# EAGLE design JDM2-2voltage-new-broken (EAGLE 7.6.0)
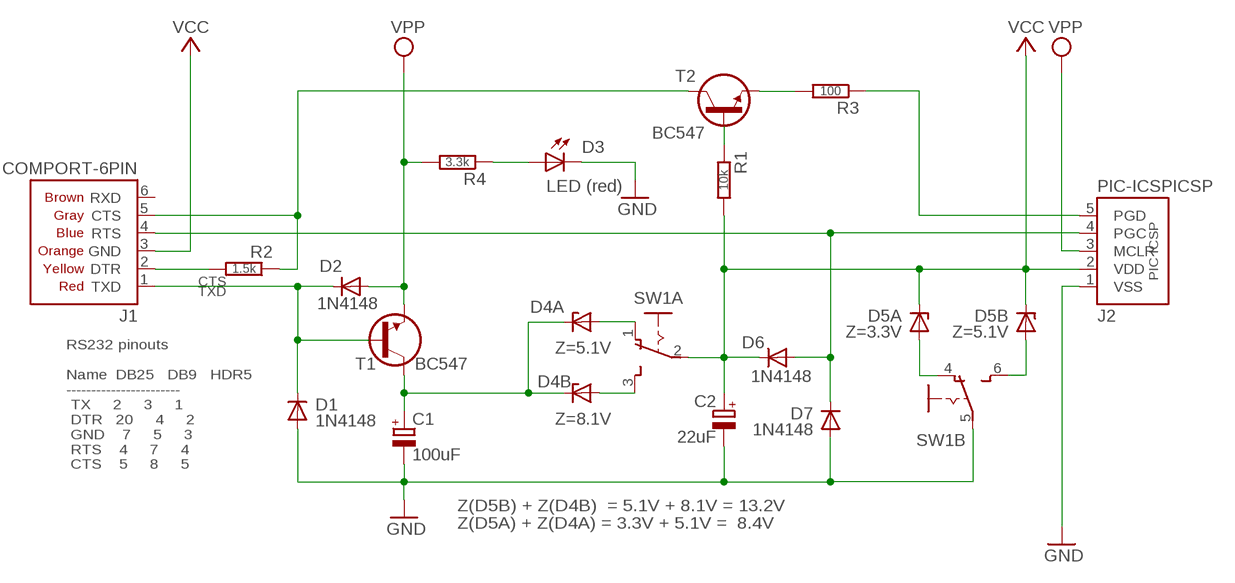
[diagram p0: schematic, sheet 1]

## Parts
C1  100uF  CPOLE5-4  [E5-4]
C2  22uF  CPOLE2,5-4  [E2,5-4]
D1  1N4148  1N414834-5  [DO34-5]
D2  1N4148  1N414834-5  [DO34-5]
D3  LED (red)  LED3MM  [LED3MM]
D4A  Z=5.1V  Z-DIODE34Z7  [DO34Z7]
D4B  Z=8.1V  Z-DIODE34Z7  [DO34Z7]
D5A  Z=3.3V  Z-DIODE34Z7V  [DO34Z7V]
D5B  Z=5.1V  Z-DIODE34Z7V  [DO34Z7V]
D6  1N4148  1N414834-7V  [DO34-7V]
D7  1N4148  1N414834-5V  [DO34-5V]
J1  COMPORT-6PIN  [RS232-6PIN]
J2  PIC-ICSPICSP  [PIC-ICSP]
R1  10k  R0202/7-V  [0202/7-V]
R2  1.5k  R0202/7-V  [0202/7-V]
R3  100  R0202/7  [0202/7]
R4  3.3k  R0202/7  [0202/7]
SW1  SL-SW-2P-2T-S  [SLSW-2P2T-H]
T1  BC547  BC547CBE  [TO92-CBE]
T2  BC547  BC547CBE  [TO92-CBE]

## Nets
/MCLR: D2.A J2.3(MCLR) R4.2 T1.E ; supply symbol labelled VPP
CLK: D6.A D7.C J1.4(RTS) J2.4(PGC)
CTS: J1.5(CTS) R2.1 T2.C
DATA: R3.2 T2.E
GND: C1.- C2.- D1.A D3.K(C) D7.A J2.1(VSS) SW1.5(B:P)
N$1: R1.1 T2.B
N$2: D5A.A SW1.4(B:O)
N$3: D5B.A SW1.6(B:S)
N$4: D4A.A SW1.1(A:O)
N$5: D3.A R4.1
N$6: D4B.A SW1.3(A:S)
N$7: J1.2(DTR) R2.2
PGD: J2.5(PGD) R3.1
TXD: D1.C D2.C J1.1(TXD) T1.B
VCC: C2.+ D5A.C D5B.C D6.C J1.3(GND) J2.2(VDD) R1.2 SW1.2(A:P)
VPP: C1.+ D4A.C D4B.C T1.C
Unconnected: J1.6(RXD)

## Notes on the sheet
- RS232 pinouts
  
  Name  DB25   DB9   HDR5
  -----------------------
   TX     2     3     1
   DTR   20     4     2
   GND    7     5     3
   RTS    4     7     4
   CTS    5     8     5
- Z(D5B) + Z(D4B)  = 5.1V + 8.1V = 13.2V
  Z(D5A) + Z(D4A) = 3.3V + 5.1V =  8.4V

## Library data of the parts
C1 C2 = c:CPOL: POLARIZED CAPACITOR, European symbol
D1 D2 D6 D7 = d:1N4148
D3 = led:LED: LED OSRAM: - CHIPLED LG R971, LG N971, LY N971, LG Q971, LY Q971, LO R971, LY R971 LH N974, LH R974 LS Q976, LO Q976, LY Q976 LO Q996 - Hyper CHIPLED LW Q18S LB Q993, LB Q99A, LB R99A - SideLED LS A670, LO A670, LY A670, LG A670, LP A670 LB A673, LV A673, LT A673, LW A673 LH A674 LY A675 LS A676, LA A676, LO A676, LY A676, LW A676 LS A679, LY A679, LG A679 - Hyper Micro SIDELED® LS Y876, LA Y876, LO Y876, LY Y876 LT Y87S - SmartLED LW L88C, LW L88S LB L89C, LB L89S, LG L890 LS L89K, LO L89K, LY L89K LS L896, LA L896, LO L896, LY L896 - TOPLED LS T670, LO T670, LY T670, LG T670, LP T670 LSG T670, LSP T670, LSY T670, LOP T670, LYG T670 LG T671, LOG T671, LSG T671 LB T673, LV T673, LT T673, LW T673 LH T674 LS T676, LA T676, LO T676, LY T676, LB T676, LH T676, LSB T676, LW T676 LB T67C, LV T67C, LT T67C, LS T67K, LO T67K, LY T67K, LW E67C LS E67B, LA E67B, LO E67B, LY E67B, LB E67C, LV E67C, LT E67C LW T67C LS T679, LY T679, LG T679 LS T770, LO T770, LY T770, LG T770, LP T770 LB T773, LV T773, LT T773, LW T773 LH T774 LS E675, LA E675, LY E675, LS T675 LS T776, LA T776, LO T776, LY T776, LB T776 LHGB T686 LT T68C, LB T68C - Hyper Mini TOPLED® LB M676 - Mini TOPLED Santana® LG M470 LS M47K, LO M47K, LY M47K Source: http://www.osram.convergy.de LUXEON: - LUMILED® LXK2-PW12-R00, LXK2-PW12-S00, LXK2-PW14-U00, LXK2-PW14-V00 LXK2-PM12-R00, LXK2-PM12-S00, LXK2-PM14-U00 LXK2-PE12-Q00, LXK2-PE12-R00, LXK2-PE12-S00, LXK2-PE14-T00, LXK2-PE14-U00 LXK2-PB12-K00, LXK2-PB12-L00, LXK2-PB12-M00, LXK2-PB14-N00, LXK2-PB14-P00, LXK2-PB14-Q00 LXK2-PR12-L00, LXK2-PR12-M00, LXK2-PR14-Q00, LXK2-PR14-R00 LXK2-PD12-Q00, LXK2-PD12-R00, LXK2-PD12-S00 LXK2-PH12-R00, LXK2-PH12-S00 LXK2-PL12-P00, LXK2-PL12-Q00, LXK2-PL12-R00 Source: www.luxeon.com KINGBRIGHT: KA-3528ASYC Source: www.kingbright.com
D4A D4B D5A D5B = d:Z-DIODE
J1 = pinconn:COMPORT-6PIN
J2 = pinconn:PIC-ICSP
R1-R4 = r:R: RESISTOR, European symbol
SW1 = sw:SL-SW-2P-2T-S
T1 T2 = t:BC547

## Net classes
0 default: width 0.559 mm
1 power: width 0.559 mm

## Board
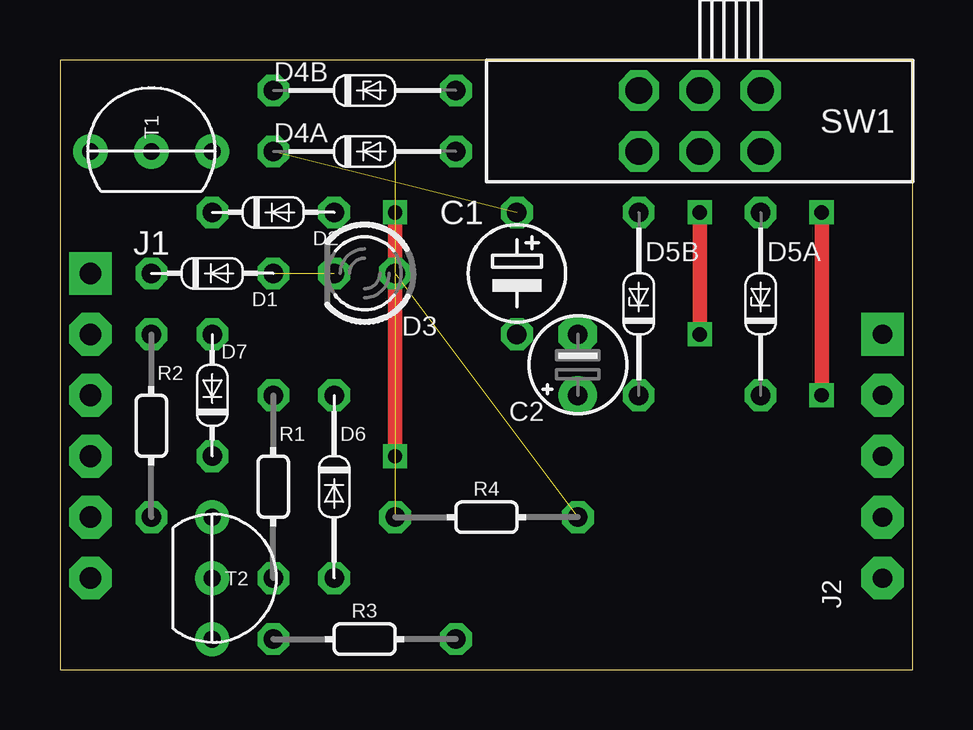
[diagram p1: board, top side]
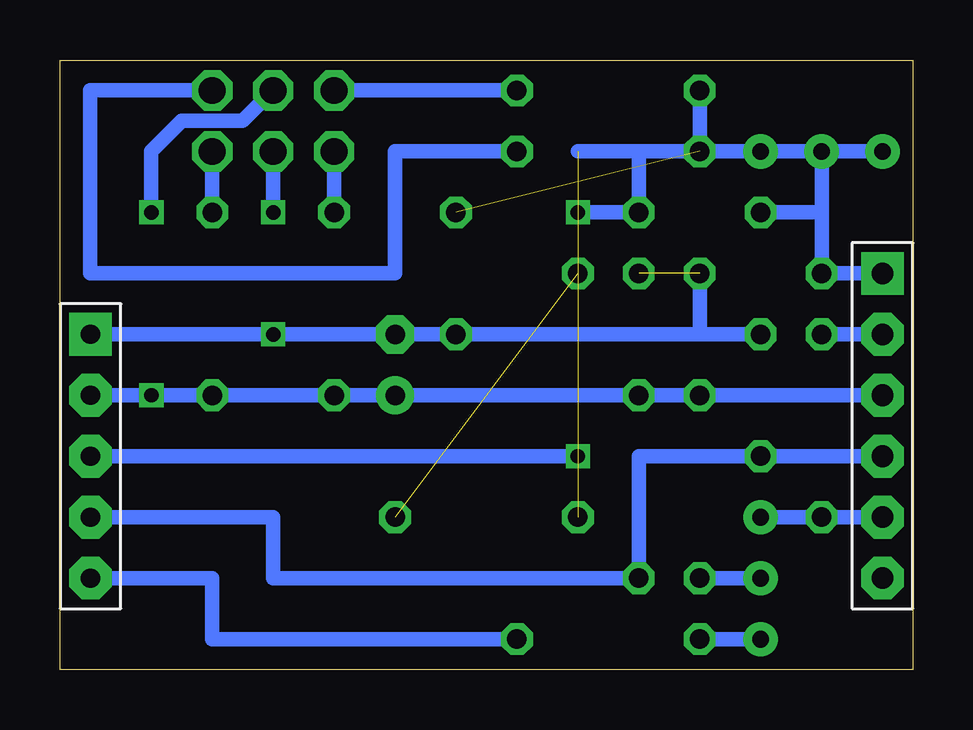
[diagram p2: board, bottom side, seen from below]

Size 35.56 x 25.4 mm. Coordinates in mm from the lower left corner, seen from the top.
Outline: 35.56,0 35.56,25.4 0,25.4 0,0 35.56,0
Copper layers (1*16): Top 0.035mm / dielectric 1.5mm / Bottom 0.035mm
Design rules "default": minimum track width 10mil, minimum drill 24mil, track to track 8mil, track to pad 8mil, pad to pad 8mil, via to via 8mil, smd to smd 8mil, copper to edge 40mil, drill to drill 8mil, minimum pad ring 10mil, minimum via ring 8mil, stop-mask expansion 4mil, vias tented up to drill 0mil, thermal gap 10mil

### Footprints (pad centres in the part's own frame; a part is rotated, then mirrored left to right if it is on the bottom)
E5-4 = drill 0.813 octagon: + 0,2.54; - 0,-2.54
E2,5-4 = drill 0.813 pad 1.6: + 0,-1.27 | drill 0.813 pad 1.6 octagon: - 0,1.27
DO34-5 = drill 0.813 octagon: A 2.54,0; C -2.54,0
LED3MM = drill 0.813 octagon: A -1.27,0; K 1.27,0
DO34Z7 = drill 0.813 octagon: A 3.81,0; C -3.81,0
DO34Z7V = drill 0.813 octagon: A 0,3.81; C 0,-3.81
DO34-7V = drill 0.813 octagon: A 0,3.81; C 0,-3.81
DO34-5V = drill 0.813 octagon: A 0,2.54; C 0,-2.54
RS232-6PIN = drill 0.9 pad 1.778 square: 1 0,0 | drill 0.9 pad 1.778 octagon: 2 2.54,0; 3 5.08,0; 4 7.62,0; 5 10.16,0; 6 12.7,0
PIC-ICSP = drill 0.8 pad 1.778 square: 1 -5.08,0 | drill 0.8 pad 1.778 octagon: 2 -2.54,0; 3 0,0; 4 2.54,0; 5 5.08,0
0202/7-V = drill 0.813 octagon: 1 0,-3.81; 2 0,3.81
0202/7 = drill 0.813 octagon: 1 -3.81,0; 2 3.81,0
SLSW-2P2T-H = drill 1.118 pad 1.524 octagon: 1 2.54,1.27; 2 0,1.27; 3 -2.54,1.27; 4 2.54,-1.27; 5 0,-1.27; 6 -2.54,-1.27
TO92-CBE = drill 0.7 pad 1.422: B 0,0; C 0,2.54; E 0,-2.54

### Placement (x,y rotation side)
C1  19.05,16.51 0 top
C2  21.59,12.7 0 top
D1  6.35,16.51 0 top
D2  8.89,19.05 0 top
D3  12.7,16.51 180 top
D4A  12.7,21.59 0 top
D4B  12.7,24.13 0 top
D5A  29.21,15.24 0 top
D5B  24.13,15.24 0 top
D6  11.43,7.62 180 top
D7  6.35,11.43 0 top
J1  1.27,16.51 270 top
J2  34.29,8.89 270 top
R1  8.89,7.62 0 top
R2  3.81,10.16 0 top
R3  12.7,1.27 180 top
R4  17.78,6.35 180 top
SW1  26.67,22.86 0 top
T1  3.81,21.59 90 top
T2  6.35,3.81 0 top

### Tracks (layer width: path | path; a pad name or v marks a point on that pad's centre or on a via)
/MCLR  (via drill 0.6)  (1 unrouted)
  Top 0.61: v13.97,8.89 v13.97,19.05
  Bottom 0.61: J2.3 v13.97,8.89 | 13.97,21.59 11.43,21.59 | 11.43,21.59 T1.E | v13.97,19.05 D2.A 11.43,21.59
CLK
  Bottom 0.61: J1.4 D7.C 11.43,8.89 D6.A 26.67,3.81 26.67,6.35 J2.4
CTS
  Bottom 0.61: J1.5 R2.1 T2.C
DATA  (via drill 0.6)
  Bottom 0.61: R3.2 T2.E
  other vias: 8.89,1.27 8.89,1.27
GND  (via drill 0.6)  (1 unrouted)
  Top 0.61: v26.67,19.05 v26.67,13.97
  Bottom 0.61: SW1.5 v26.67,19.05 | J2.1 v26.67,13.97 C2.- C1.- 8.89,13.97 | 8.89,13.97 D1.A | D7.A 8.89,13.97
N$1
  Bottom 0.61: R1.1 T2.B
N$2
  Bottom 0.61: D5A.A SW1.4
N$3
  Bottom 0.61: SW1.6 D5B.A
N$4
  Bottom 0.61: SW1.1 34.29,24.13 34.29,16.51 21.59,16.51 21.59,21.59 D4A.A
N$5  (1 unrouted)
N$6
  Bottom 0.61: D4B.A SW1.3
N$7
  Bottom 0.61: R2.2 J1.2
PGD
  Bottom 0.61: J2.5 29.21,3.81 29.21,1.27 R3.1
TXD
  Bottom 0.61: J1.1 D1.C 3.81,19.05 | 3.81,19.05 T1.B | D2.C 3.81,19.05
VCC  (via drill 0.6)
  Top 0.61: v31.75,11.43 v31.75,19.05
  Bottom 0.61: J2.2 v31.75,11.43 D5A.C D5B.C C2.+ D6.C R1.2 J1.3 | v31.75,19.05 31.75,21.59 30.48,22.86 27.94,22.86 SW1.2
VPP  (1 unrouted)
  Bottom 0.61: D4B.C D4A.C T1.C

### Text on the board
Dimension: 10 | 9 | 8 | 7 | 6 | 5 | 4 | 3 | 2 | 1 | 1 | 2 | 3 | 4 | 5 | 6 | 7 | 8 | 9 | 10 | 11 | 12 | 13 | 14 | 14